# Altium schematic sheet Pg03_ AM335X Section 2 .SchDoc: PROCESSOR 2 OF 3
size A2; DrawnBy: RvS; DocumentNumber: 3; SheetNumber: 3; SheetTotal: 16; PageSetup: Record=PageOptions|CenterHorizontal=True|CenterVertical=True|PrintScale=0.51|XCorrection=1.00|YCorrection=1.00|PrintKind=1|BorderSize=5000000|LeftOffset=0|BottomOffset=0|Orientation=2|PaperLength=1000|PaperWidth=1000|Scale=100|PaperSource=15|PrintQuality=600|MediaType=1|DitherType=10|PaperKind=A4|PrintScaleMode=1
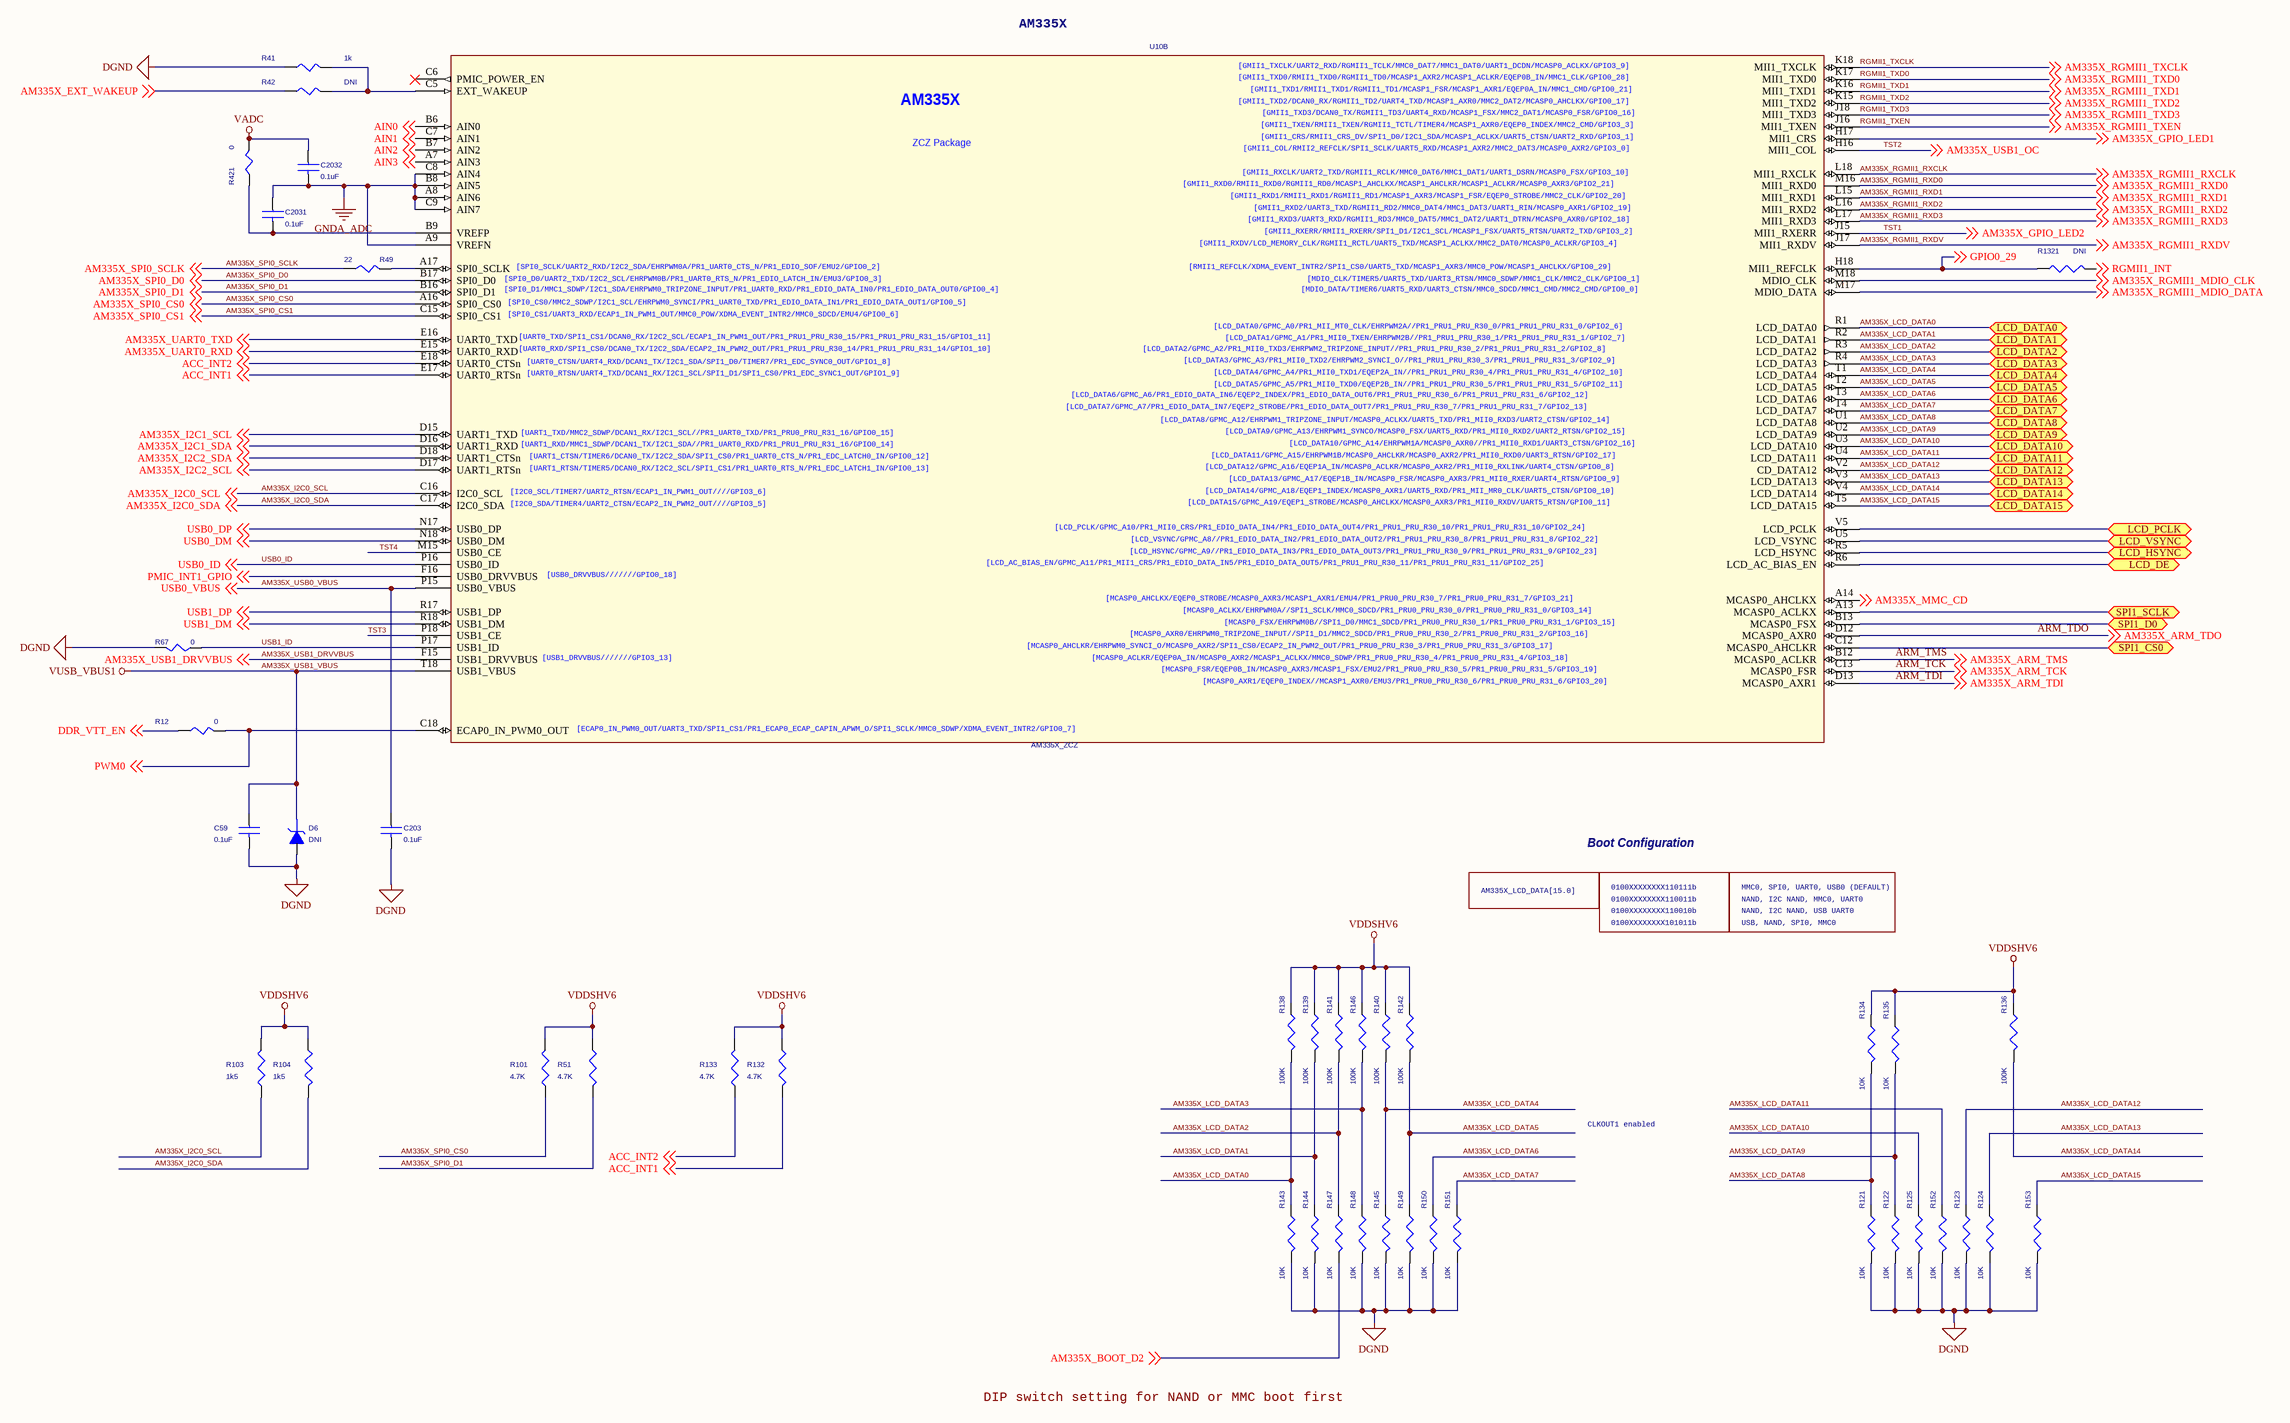
[diagram p0: Pg03_ AM335X Section 2 .SchDoc]

## Parts
?  (no value)  (graphical)
C59  0.1uF  [SM-7351-CAP-0402]
C203  0.1uF  [SM-7351-CAP-0402]
C2031  0.1uF  [SM-7351-CAP-0402]
C2032  0.1uF  [SM-7351-CAP-0402]
D6  DNI  [GMD2_2pin]
R12  0  [SM-7351-RES-0402]
R41  1k  [SM-7351-RES-0402]
R42  DNI  [SM-7351-RES-0402]
R49  22  [SM-7351-RES-0402]
R51  4.7K  [SM-7351-RES-0402]
R67  0  [SM-7351-RES-0402]
R101  4.7K  [SM-7351-RES-0402]
R103  1k5  [SM-7351-RES-0402]
R104  1k5  [SM-7351-RES-0402]
R121  10K  [SM-7351-RES-0402]
R122  10K  [SM-7351-RES-0402]
R123  10K  [SM-7351-RES-0402]
R124  10K  [SM-7351-RES-0402]
R125  10K  [SM-7351-RES-0402]
R132  4.7K  [SM-7351-RES-0402]
R133  4.7K  [SM-7351-RES-0402]
R134  10K  [SM-7351-RES-0402]
R135  10K  [SM-7351-RES-0402]
R136  100K  [SM-7351-RES-0402]
R138  100K  [SM-7351-RES-0402]
R139  100K  [SM-7351-RES-0402]
R140  100K  [SM-7351-RES-0402]
R141  100K  [SM-7351-RES-0402]
R142  100K  [SM-7351-RES-0402]
R143  10K  [SM-7351-RES-0402]
R144  10K  [SM-7351-RES-0402]
R145  10K  [SM-7351-RES-0402]
R146  100K  [SM-7351-RES-0402]
R147  10K  [SM-7351-RES-0402]
R148  10K  [SM-7351-RES-0402]
R149  10K  [SM-7351-RES-0402]
R150  10K  [SM-7351-RES-0402]
R151  10K  [SM-7351-RES-0402]
R152  10K  [SM-7351-RES-0402]
R153  10K  [SM-7351-RES-0402]
R421  0  [SM-7351-RES-0402]
R1321  DNI  [SM-7351-RES-0402]
U10  AM335X_ZCZ  [BGA15X15-324-55M]  (part B of 3)

## Ports
LCD_DATA0, LCD_DATA1, LCD_DATA2, LCD_DATA3, LCD_DATA4, LCD_DATA5, LCD_DATA6, LCD_DATA7, LCD_DATA8, LCD_DATA9, LCD_DATA10, LCD_DATA11, LCD_DATA12, LCD_DATA13, LCD_DATA14, LCD_DATA15, LCD_DE, LCD_HSYNC, LCD_PCLK, LCD_VSYNC, SPI1_CS0, SPI1_D0, SPI1_SCLK

## Nets
AM335X_USB1_VBUS: C59.1 D6.1(CATHODE) U10.T18(USB1_VBUS)  [also labelled VUSB_VBUS1]
DGND: C59.2 C203.2 D6.2(ANODE) R41.2(P2) R67.1(P1) R121.1(P1) R122.1(P1) R123.1(P1) R124.1(P1) R125.1(P1) R143.1(P1) R144.1(P1) R145.1(P1) R148.1(P1) R149.1(P1) R150.1(P1) R151.1(P1) R152.1(P1) R153.1(P1)
GNDA_ADC: C2031.1 C2032.2 U10.A8(AIN6) U10.A9(VREFN) U10.B8(AIN5) U10.C8(AIN4) U10.C9(AIN7)
VADC: C2032.1 R421.1(P1)
VDDSHV6: R51.2(P2) R101.2(P2) R103.2(P2) R104.2(P2) R132.2(P2) R133.2(P2) R134.2(P2) R135.2(P2) R136.2(P2) R138.2(P2) R139.2(P2) R140.2(P2) R141.2(P2) R142.2(P2) R146.2(P2)
ACC_INT1: R132.1(P1) U10.E17(UART0_RTSn) ; off-sheet ACC_INT1
ACC_INT2: R133.1(P1) U10.E18(UART0_CTSn) ; off-sheet ACC_INT2
AIN0: U10.B6(AIN0) ; off-sheet AIN0
AIN1: U10.C7(AIN1) ; off-sheet AIN1
AIN2: U10.B7(AIN2) ; off-sheet AIN2
AIN3: U10.A7(AIN3) ; off-sheet AIN3
AM335X_BOOT_D2: R147.1(P1) ; off-sheet AM335X_BOOT_D2
AM335X_EXT_WAKEUP: R42.2(P2) ; off-sheet AM335X_EXT_WAKEUP
AM335X_GPIO_LED1: U10.H17(MII1_CRS) ; off-sheet AM335X_GPIO_LED1
AM335X_I2C0_SCL: R103.1(P1) U10.C16(I2C0_SCL) ; off-sheet AM335X_I2C0_SCL
AM335X_I2C0_SDA: R104.1(P1) U10.C17(I2C0_SDA) ; off-sheet AM335X_I2C0_SDA
AM335X_I2C1_SCL: U10.D15(UART1_TXD) ; off-sheet AM335X_I2C1_SCL
AM335X_I2C1_SDA: U10.D16(UART1_RXD) ; off-sheet AM335X_I2C1_SDA
AM335X_I2C2_SCL: U10.D17(UART1_RTSn) ; off-sheet AM335X_I2C2_SCL
AM335X_I2C2_SDA: U10.D18(UART1_CTSn) ; off-sheet AM335X_I2C2_SDA
AM335X_LCD_DATA0: R138.1(P1) R143.2(P2) U10.R1(LCD_DATA0) ; port LCD_DATA0
AM335X_LCD_DATA1: R139.1(P1) R144.2(P2) U10.R2(LCD_DATA1) ; port LCD_DATA1
AM335X_LCD_DATA2: R141.1(P1) R147.2(P2) U10.R3(LCD_DATA2) ; port LCD_DATA2
AM335X_LCD_DATA3: R146.1(P1) R148.2(P2) U10.R4(LCD_DATA3) ; port LCD_DATA3
AM335X_LCD_DATA4: R140.1(P1) R145.2(P2) U10.T1(LCD_DATA4) ; port LCD_DATA4
AM335X_LCD_DATA5: R142.1(P1) R149.2(P2) U10.T2(LCD_DATA5) ; port LCD_DATA5
AM335X_LCD_DATA6: R150.2(P2) U10.T3(LCD_DATA6) ; port LCD_DATA6
AM335X_LCD_DATA7: R151.2(P2) U10.T4(LCD_DATA7) ; port LCD_DATA7
AM335X_LCD_DATA8: R121.2(P2) R134.1(P1) U10.U1(LCD_DATA8) ; port LCD_DATA8
AM335X_LCD_DATA9: R122.2(P2) R135.1(P1) U10.U2(LCD_DATA9) ; port LCD_DATA9
AM335X_LCD_DATA10: R125.2(P2) U10.U3(LCD_DATA10) ; port LCD_DATA10
AM335X_LCD_DATA11: R152.2(P2) U10.U4(LCD_DATA11) ; port LCD_DATA11
AM335X_LCD_DATA12: R123.2(P2) U10.V2(CD_DATA12) ; port LCD_DATA12
AM335X_LCD_DATA13: R124.2(P2) U10.V3(LCD_DATA13) ; port LCD_DATA13
AM335X_LCD_DATA14: R136.1(P1) U10.V4(LCD_DATA14) ; port LCD_DATA14
AM335X_LCD_DATA15: R153.2(P2) U10.T5(LCD_DATA15) ; port LCD_DATA15
AM335X_MMC_CD: U10.A14(MCASP0_AHCLKX) ; off-sheet AM335X_MMC_CD
AM335X_RGMII1_MDIO_CLK: U10.M18(MDIO_CLK) ; off-sheet AM335X_RGMII1_MDIO_CLK
AM335X_RGMII1_MDIO_DATA: U10.M17(MDIO_DATA) ; off-sheet AM335X_RGMII1_MDIO_DATA
AM335X_RGMII1_RXCLK: U10.L18(MII1_RXCLK) ; off-sheet AM335X_RGMII1_RXCLK
AM335X_RGMII1_RXD0: U10.M16(MII1_RXD0) ; off-sheet AM335X_RGMII1_RXD0
AM335X_RGMII1_RXD1: U10.L15(MII1_RXD1) ; off-sheet AM335X_RGMII1_RXD1
AM335X_RGMII1_RXD2: U10.L16(MII1_RXD2) ; off-sheet AM335X_RGMII1_RXD2
AM335X_RGMII1_RXD3: U10.L17(MII1_RXD3) ; off-sheet AM335X_RGMII1_RXD3
AM335X_RGMII1_RXDV: U10.J17(MII1_RXDV) ; off-sheet AM335X_RGMII1_RXDV
AM335X_SPI0_CS0: R101.1(P1) U10.A16(SPI0_CS0) ; off-sheet AM335X_SPI0_CS0
AM335X_SPI0_CS1: U10.C15(SPI0_CS1) ; off-sheet AM335X_SPI0_CS1
AM335X_SPI0_D0: U10.B17(SPI0_D0) ; off-sheet AM335X_SPI0_D0
AM335X_SPI0_D1: R51.1(P1) U10.B16(SPI0_D1) ; off-sheet AM335X_SPI0_D1
AM335X_SPI0_SCLK: R49.2(P2) ; off-sheet AM335X_SPI0_SCLK
AM335X_UART0_RXD: U10.E15(UART0_RXD) ; off-sheet AM335X_UART0_RXD
AM335X_UART0_TXD: U10.E16(UART0_TXD) ; off-sheet AM335X_UART0_TXD
AM335X_USB0_VBUS: C203.1 U10.P15(USB0_VBUS) ; off-sheet USB0_VBUS  [also labelled USB0_VBUS]
AM335X_USB1_DRVVBUS: U10.F15(USB1_DRVVBUS) ; off-sheet AM335X_USB1_DRVVBUS
ARM_TCK: U10.C13(MCASP0_FSR) ; off-sheet AM335X_ARM_TCK  [also labelled AM335X_ARM_TCK]
ARM_TDI: U10.D13(MCASP0_AXR1) ; off-sheet AM335X_ARM_TDI  [also labelled AM335X_ARM_TDI]
ARM_TDO: U10.D12(MCASP0_AXR0) ; off-sheet AM335X_ARM_TDO  [also labelled AM335X_ARM_TDO]
ARM_TMS: U10.B12(MCASP0_ACLKR) ; off-sheet AM335X_ARM_TMS  [also labelled AM335X_ARM_TMS]
DDR_VTT_EN: R12.2(P2) ; off-sheet DDR_VTT_EN
GPIO0_29: R1321.2(P2) U10.H18(MII1_REFCLK) ; off-sheet GPIO0_29
LCD_DE: U10.R6(LCD_AC_BIAS_EN) ; port LCD_DE
LCD_HSYNC: U10.R5(LCD_HSYNC) ; port LCD_HSYNC
LCD_PCLK: U10.V5(LCD_PCLK) ; port LCD_PCLK
LCD_VSYNC: U10.U5(LCD_VSYNC) ; port LCD_VSYNC
PMIC_INT1_GPIO: U10.F16(USB0_DRVVBUS) ; off-sheet PMIC_INT1_GPIO
PWM0: R12.1(P1) U10.C18(ECAP0_IN_PWM0_OUT) ; off-sheet PWM0
RGMII1_INT: R1321.1(P1) ; off-sheet RGMII1_INT
RGMII1_TXCLK: U10.K18(MII1_TXCLK) ; off-sheet AM335X_RGMII1_TXCLK  [also labelled AM335X_RGMII1_TXCLK]
RGMII1_TXD0: U10.K17(MII1_TXD0) ; off-sheet AM335X_RGMII1_TXD0  [also labelled AM335X_RGMII1_TXD0]
RGMII1_TXD1: U10.K16(MII1_TXD1) ; off-sheet AM335X_RGMII1_TXD1  [also labelled AM335X_RGMII1_TXD1]
RGMII1_TXD2: U10.K15(MII1_TXD2) ; off-sheet AM335X_RGMII1_TXD2  [also labelled AM335X_RGMII1_TXD2]
RGMII1_TXD3: U10.J18(MII1_TXD3) ; off-sheet AM335X_RGMII1_TXD3  [also labelled AM335X_RGMII1_TXD3]
RGMII1_TXEN: U10.J16(MII1_TXEN) ; off-sheet AM335X_RGMII1_TXEN  [also labelled AM335X_RGMII1_TXEN]
SPI1_CS0: U10.C12(MCASP0_AHCLKR) ; port SPI1_CS0
SPI1_D0: U10.B13(MCASP0_FSX) ; port SPI1_D0
SPI1_SCLK: U10.A13(MCASP0_ACLKX) ; port SPI1_SCLK
TST1: U10.J15(MII1_RXERR) ; off-sheet AM335X_GPIO_LED2  [also labelled AM335X_GPIO_LED2]
TST2: U10.H16(MII1_COL) ; off-sheet AM335X_USB1_OC  [also labelled AM335X_USB1_OC]
TST3: U10.P18(USB1_CE)
TST4: U10.M15(USB0_CE)
USB0_DM: U10.N18(USB0_DM) ; off-sheet USB0_DM
USB0_DP: U10.N17(USB0_DP) ; off-sheet USB0_DP
USB0_ID: U10.P16(USB0_ID) ; off-sheet USB0_ID
USB1_DM: U10.R18(USB1_DM) ; off-sheet USB1_DM
USB1_DP: U10.R17(USB1_DP) ; off-sheet USB1_DP
USB1_ID: R67.2(P2) U10.P17(USB1_ID)
NetC2031_2: C2031.2 R421.2(P2) U10.B9(VREFP)
NetR41_1: R41.1(P1) R42.1(P1) U10.C5(EXT_WAKEUP)
NetR49_1: R49.1(P1) U10.A17(SPI0_SCLK)

Not connected (* = marked no-connect by the designer): U10 C6(PMIC_POWER_EN)*

## Notes on the sheet
- (near U10) AM335X
- Boot Configuration
- AM335X_LCD_DATA[15.0]
- 0100XXXXXXXX110111b
- 0100XXXXXXXX110011b
- 0100XXXXXXXX110010b
- 0100XXXXXXXX101011b
- MMC0, SPI0, UART0, USB0 (DEFAULT)
- NAND, I2C NAND, MMC0, UART0
- NAND, I2C NAND, USB UART0
- USB, NAND, SPI0, MMC0
- CLKOUT1 enabled
- DIP switch setting for NAND or MMC boot first
- Embedded Vision Systems Group
- Title
- School of Electrical and Electronic Engineering
- Date:
- Size
- Document Number
- Sheet
- of
- Rev
- (in symbol AM335X_15mmx15mm, part B) [GMII1_TXCLK/UART2_RXD/RGMII1_TCLK/MMC0_DAT7/MMC1_DAT0/UART1_DCDN/MCASP0_ACLKX/GPIO3_9]; [GMII1_TXD0/RMII1_TXD0/RGMII1_TD0/MCASP1_AXR2/MCASP1_ACLKR/EQEP0B_IN/MMC1_CLK/GPIO0_28]; [GMII1_TXD1/RMII1_TXD1/RGMII1_TD1/MCASP1_FSR/MCASP1_AXR1/EQEP0A_IN/MMC1_CMD/GPIO0_21]; AM335X; [GMII1_TXD2/DCAN0_RX/RGMII1_TD2/UART4_TXD/MCASP1_AXR0/MMC2_DAT2/MCASP0_AHCLKX/GPIO0_17]; [GMII1_TXD3/DCAN0_TX/RGMII1_TD3/UART4_RXD/MCASP1_FSX/MMC2_DAT1/MCASP0_FSR/GPIO0_16]; [GMII1_TXEN/RMII1_TXEN/RGMII1_TCTL/TIMER4/MCASP1_AXR0/EQEP0_INDEX/MMC2_CMD/GPIO3_3]; [GMII1_CRS/RMII1_CRS_DV/SPI1_D0/I2C1_SDA/MCASP1_ACLKX/UART5_CTSN/UART2_RXD/GPIO3_1]; ZCZ Package; [GMII1_COL/RMII2_REFCLK/SPI1_SCLK/UART5_RXD/MCASP1_AXR2/MMC2_DAT3/MCASP0_AXR2/GPIO3_0]; [GMII1_RXCLK/UART2_TXD/RGMII1_RCLK/MMC0_DAT6/MMC1_DAT1/UART1_DSRN/MCASP0_FSX/GPIO3_10]; [GMII1_RXD0/RMII1_RXD0/RGMII1_RD0/MCASP1_AHCLKX/MCASP1_AHCLKR/MCASP1_ACLKR/MCASP0_AXR3/GPIO2_21]; [GMII1_RXD1/RMII1_RXD1/RGMII1_RD1/MCASP1_AXR3/MCASP1_FSR/EQEP0_STROBE/MMC2_CLK/GPIO2_20]; [GMII1_RXD2/UART3_TXD/RGMII1_RD2/MMC0_DAT4/MMC1_DAT3/UART1_RIN/MCASP0_AXR1/GPIO2_19]; [GMII1_RXD3/UART3_RXD/RGMII1_RD3/MMC0_DAT5/MMC1_DAT2/UART1_DTRN/MCASP0_AXR0/GPIO2_18]; [GMII1_RXERR/RMII1_RXERR/SPI1_D1/I2C1_SCL/MCASP1_FSX/UART5_RTSN/UART2_TXD/GPIO3_2]; [GMII1_RXDV/LCD_MEMORY_CLK/RGMII1_RCTL/UART5_TXD/MCASP1_ACLKX/MMC2_DAT0/MCASP0_ACLKR/GPIO3_4]; [SPI0_SCLK/UART2_RXD/I2C2_SDA/EHRPWM0A/PR1_UART0_CTS_N/PR1_EDIO_SOF/EMU2/GPIO0_2]; [RMII1_REFCLK/XDMA_EVENT_INTR2/SPI1_CS0/UART5_TXD/MCASP1_AXR3/MMC0_POW/MCASP1_AHCLKX/GPIO0_29]; [SPI0_D0/UART2_TXD/I2C2_SCL/EHRPWM0B/PR1_UART0_RTS_N/PR1_EDIO_LATCH_IN/EMU3/GPIO0_3]; [MDIO_CLK/TIMER5/UART5_TXD/UART3_RTSN/MMC0_SDWP/MMC1_CLK/MMC2_CLK/GPIO0_1]; [SPI0_D1/MMC1_SDWP/I2C1_SDA/EHRPWM0_TRIPZONE_INPUT/PR1_UART0_RXD/PR1_EDIO_DATA_IN0/PR1_EDIO_DATA_OUT0/GPIO0_4]; [MDIO_DATA/TIMER6/UART5_RXD/UART3_CTSN/MMC0_SDCD/MMC1_CMD/MMC2_CMD/GPIO0_0]; [SPI0_CS0/MMC2_SDWP/I2C1_SCL/EHRPWM0_SYNCI/PR1_UART0_TXD/PR1_EDIO_DATA_IN1/PR1_EDIO_DATA_OUT1/GPIO0_5]; [SPI0_CS1/UART3_RXD/ECAP1_IN_PWM1_OUT/MMC0_POW/XDMA_EVENT_INTR2/MMC0_SDCD/EMU4/GPIO0_6]; [LCD_DATA0/GPMC_A0/PR1_MII_MT0_CLK/EHRPWM2A//PR1_PRU1_PRU_R30_0/PR1_PRU1_PRU_R31_0/GPIO2_6]; [UART0_TXD/SPI1_CS1/DCAN0_RX/I2C2_SCL/ECAP1_IN_PWM1_OUT/PR1_PRU1_PRU_R30_15/PR1_PRU1_PRU_R31_15/GPIO1_11]; [LCD_DATA1/GPMC_A1/PR1_MII0_TXEN/EHRPWM2B//PR1_PRU1_PRU_R30_1/PR1_PRU1_PRU_R31_1/GPIO2_7]; [UART0_RXD/SPI1_CS0/DCAN0_TX/I2C2_SDA/ECAP2_IN_PWM2_OUT/PR1_PRU1_PRU_R30_14/PR1_PRU1_PRU_R31_14/GPIO1_10]; [LCD_DATA2/GPMC_A2/PR1_MII0_TXD3/EHRPWM2_TRIPZONE_INPUT//PR1_PRU1_PRU_R30_2/PR1_PRU1_PRU_R31_2/GPIO2_8]; [LCD_DATA3/GPMC_A3/PR1_MII0_TXD2/EHRPWM2_SYNCI_O//PR1_PRU1_PRU_R30_3/PR1_PRU1_PRU_R31_3/GPIO2_9]; [UART0_CTSN/UART4_RXD/DCAN1_TX/I2C1_SDA/SPI1_D0/TIMER7/PR1_EDC_SYNC0_OUT/GPIO1_8]; [LCD_DATA4/GPMC_A4/PR1_MII0_TXD1/EQEP2A_IN//PR1_PRU1_PRU_R30_4/PR1_PRU1_PRU_R31_4/GPIO2_10]; [UART0_RTSN/UART4_TXD/DCAN1_RX/I2C1_SCL/SPI1_D1/SPI1_CS0/PR1_EDC_SYNC1_OUT/GPIO1_9]; [LCD_DATA5/GPMC_A5/PR1_MII0_TXD0/EQEP2B_IN//PR1_PRU1_PRU_R30_5/PR1_PRU1_PRU_R31_5/GPIO2_11]; [LCD_DATA6/GPMC_A6/PR1_EDIO_DATA_IN6/EQEP2_INDEX/PR1_EDIO_DATA_OUT6/PR1_PRU1_PRU_R30_6/PR1_PRU1_PRU_R31_6/GPIO2_12]; [LCD_DATA7/GPMC_A7/PR1_EDIO_DATA_IN7/EQEP2_STROBE/PR1_EDIO_DATA_OUT7/PR1_PRU1_PRU_R30_7/PR1_PRU1_PRU_R31_7/GPIO2_13]; [LCD_DATA8/GPMC_A12/EHRPWM1_TRIPZONE_INPUT/MCASP0_ACLKX/UART5_TXD/PR1_MII0_RXD3/UART2_CTSN/GPIO2_14]; [LCD_DATA9/GPMC_A13/EHRPWM1_SYNCO/MCASP0_FSX/UART5_RXD/PR1_MII0_RXD2/UART2_RTSN/GPIO2_15]; [UART1_TXD/MMC2_SDWP/DCAN1_RX/I2C1_SCL//PR1_UART0_TXD/PR1_PRU0_PRU_R31_16/GPIO0_15]; [LCD_DATA10/GPMC_A14/EHRPWM1A/MCASP0_AXR0//PR1_MII0_RXD1/UART3_CTSN/GPIO2_16]; [UART1_RXD/MMC1_SDWP/DCAN1_TX/I2C1_SDA//PR1_UART0_RXD/PR1_PRU1_PRU_R31_16/GPIO0_14]; [LCD_DATA11/GPMC_A15/EHRPWM1B/MCASP0_AHCLKR/MCASP0_AXR2/PR1_MII0_RXD0/UART3_RTSN/GPIO2_17]; [UART1_CTSN/TIMER6/DCAN0_TX/I2C2_SDA/SPI1_CS0/PR1_UART0_CTS_N/PR1_EDC_LATCH0_IN/GPIO0_12]; [LCD_DATA12/GPMC_A16/EQEP1A_IN/MCASP0_ACLKR/MCASP0_AXR2/PR1_MII0_RXLINK/UART4_CTSN/GPIO0_8]; [UART1_RTSN/TIMER5/DCAN0_RX/I2C2_SCL/SPI1_CS1/PR1_UART0_RTS_N/PR1_EDC_LATCH1_IN/GPIO0_13]; [LCD_DATA13/GPMC_A17/EQEP1B_IN/MCASP0_FSR/MCASP0_AXR3/PR1_MII0_RXER/UART4_RTSN/GPIO0_9]; [LCD_DATA14/GPMC_A18/EQEP1_INDEX/MCASP0_AXR1/UART5_RXD/PR1_MII_MR0_CLK/UART5_CTSN/GPIO0_10]; [I2C0_SCL/TIMER7/UART2_RTSN/ECAP1_IN_PWM1_OUT////GPIO3_6]; [LCD_DATA15/GPMC_A19/EQEP1_STROBE/MCASP0_AHCLKX/MCASP0_AXR3/PR1_MII0_RXDV/UART5_RTSN/GPIO0_11]; [I2C0_SDA/TIMER4/UART2_CTSN/ECAP2_IN_PWM2_OUT////GPIO3_5]; [LCD_PCLK/GPMC_A10/PR1_MII0_CRS/PR1_EDIO_DATA_IN4/PR1_EDIO_DATA_OUT4/PR1_PRU1_PRU_R30_10/PR1_PRU1_PRU_R31_10/GPIO2_24]; [LCD_VSYNC/GPMC_A8//PR1_EDIO_DATA_IN2/PR1_EDIO_DATA_OUT2/PR1_PRU1_PRU_R30_8/PR1_PRU1_PRU_R31_8/GPIO2_22]; [LCD_HSYNC/GPMC_A9//PR1_EDIO_DATA_IN3/PR1_EDIO_DATA_OUT3/PR1_PRU1_PRU_R30_9/PR1_PRU1_PRU_R31_9/GPIO2_23]; [LCD_AC_BIAS_EN/GPMC_A11/PR1_MII1_CRS/PR1_EDIO_DATA_IN5/PR1_EDIO_DATA_OUT5/PR1_PRU1_PRU_R30_11/PR1_PRU1_PRU_R31_11/GPIO2_25]; [USB0_DRVVBUS///////GPIO0_18]; [MCASP0_AHCLKX/EQEP0_STROBE/MCASP0_AXR3/MCASP1_AXR1/EMU4/PR1_PRU0_PRU_R30_7/PR1_PRU0_PRU_R31_7/GPIO3_21]; [MCASP0_ACLKX/EHRPWM0A//SPI1_SCLK/MMC0_SDCD/PR1_PRU0_PRU_R30_0/PR1_PRU0_PRU_R31_0/GPIO3_14]; [MCASP0_FSX/EHRPWM0B//SPI1_D0/MMC1_SDCD/PR1_PRU0_PRU_R30_1/PR1_PRU0_PRU_R31_1/GPIO3_15]; [MCASP0_AXR0/EHRPWM0_TRIPZONE_INPUT//SPI1_D1/MMC2_SDCD/PR1_PRU0_PRU_R30_2/PR1_PRU0_PRU_R31_2/GPIO3_16]; [MCASP0_AHCLKR/EHRPWM0_SYNCI_O/MCASP0_AXR2/SPI1_CS0/ECAP2_IN_PWM2_OUT/PR1_PRU0_PRU_R30_3/PR1_PRU0_PRU_R31_3/GPIO3_17]; [USB1_DRVVBUS///////GPIO3_13]; [MCASP0_ACLKR/EQEP0A_IN/MCASP0_AXR2/MCASP1_ACLKX/MMC0_SDWP/PR1_PRU0_PRU_R30_4/PR1_PRU0_PRU_R31_4/GPIO3_18]; [MCASP0_FSR/EQEP0B_IN/MCASP0_AXR3/MCASP1_FSX/EMU2/PR1_PRU0_PRU_R30_5/PR1_PRU0_PRU_R31_5/GPIO3_19]; [MCASP0_AXR1/EQEP0_INDEX//MCASP1_AXR0/EMU3/PR1_PRU0_PRU_R30_6/PR1_PRU0_PRU_R31_6/GPIO3_20]; [ECAP0_IN_PWM0_OUT/UART3_TXD/SPI1_CS1/PR1_ECAP0_ECAP_CAPIN_APWM_O/SPI1_SCLK/MMC0_SDWP/XDMA_EVENT_INTR2/GPIO0_7]

## Library data of the parts
? = Title Block Address(1): UoM title block
C59 C203 C2031 C2032 = 0.1uFCapacitor16V10%0402_Dup1: TIIntPartnumber: 1C0089; MfrNum: C0402C104K4RACT; Mfr: Kemet; PartName: 0.1uF16V10%SMD0402; DescriptiveText: Capacitor 0.1uF 16V 10% 0402 X7R; Cost10K: 0.015; Cost100: 0.11; Vendor: Digikey
D6 = Diode_Zener_5.1V_100mW: Voltage Surpressor 15.0V; PartName: DiodeZener5.1V_100mW; Mfr: Rohm; MfrNum: GDZT2R5.1; TIIntPartnumber: 1E0020; DescriptiveText: Diode Zener 5.1V 100mW; Vendor: Digikey; Cost100: 0.149; Cost10K: 0.068; Descriptive_Text: Voltage Surpressor 15.0V
R12 = ZeroOhmResistor1/16W0402: PartName: ZeroohmSMD0402; Mfr: Panasonic; MfrNum: ERJ-2GE0R00X; TIIntPartnumber: 1R0098; DescriptiveText: Resistor Zero ohm Jumper 0402; Vendor: Digikey; Cost100: 0.08; Cost10K: 0.0020
R41 R42 R421 = ZeroOhmResistor1/16W0402_Dup2: Resistor Zero ohm Jumper 0402; PartName: ZeroohmSMD0402; Mfr: Panasonic; MfrNum: ERJ-2GE0R00X; TIIntPartnumber: 1R0098; Vendor: DIGIKEY; Cost100: 0.08; Cost10K: 0.0020; DescriptiveText: Resistor Zero ohm Jumper 0402; Descriptive_Text: Resistor Zero ohm Jumper 0402
R49 = 22OhmResistor1/16W1%0402: Resistor 22 ohm 1/16W 1% 0402; PartName: 22ohm1/161%smd0402; Mfr: ROHM; MfrNum: MCR01MZPF22R0; TIIntPartnumber: 1R0175; Vendor: Digikey; Cost100: 0.069; Cost10K: 0.00529; DescriptiveText: Resistor 22 ohm 1/16W 1% 0402; Descriptive_Text: Resistor 22 ohm 1/16W 1% 0402
R51 R101 R103 R104 R132 R133 R1321 = 4.7KOhmResistor1/16W0402_Dup1: Resistor 4.7Kohm 1/16W 5% 0402; TIIntPartnumber: 1R0183; MfrNum: RMCF0402JT4K70; Mfr: Stackpole Electronics; PartName: 4.7Kohm1/16W5%smd0402; Cost10K: 0.02465; Cost100: 0.007; Vendor: Digikey; DescriptiveText: Resistor 4.7Kohm 1/16W 5% 0402; Descriptive_Text: Resistor 4.7Kohm 1/16W 5% 0402
R67 = ZeroOhmResistor1/16W0402_Dup4: Resistor Zero ohm Jumper 0402; TIIntPartnumber: 1R0098; MfrNum: ERJ-2GE0R00X; Mfr: Panasonic; PartName: ZeroohmSMD0402; Cost10K: 0.0020; Cost100: 0.08; Vendor: Digikey; Descriptive_Text: Resistor Zero ohm Jumper 0402; DescriptiveText: Resistor Zero ohm Jumper 0402
R121-R125 R134 R135 R143-R145 R147-R153 = 10KOhmResistor1/16W0402_Dup1: Resistor 10Kohm 1/16W 5% 0402; TIIntPartnumber: 1R0168; MfrNum: MCR01MZPJ103; Mfr: Rohm; PartName: 10Kohm1/16W5%SMD0402; Cost10K: 0.0017; Cost100: 0.03; Vendor: Digikey; Descriptive_Text: Resistor 10Kohm 1/16W 5% 0402; DescriptiveText: Resistor 10Kohm 1/16W 5% 0402
R136 R138-R142 R146 = 100KOhmResistor1/16W0402_Dup1: TIIntPartnumber: 1R0181; MfrNum: RMCF0402FT100K; Mfr: Stackpole Electronics; PartName: 100Kohm1/16W1%SMD0402; DescriptiveText: Resistor 100Kohm 1/16W 1% 0402; Cost10K: 0.0020; Cost100: 0.0105; Vendor: Digikey
U10 = AM335X_15mmx15mm: TIIntPartnumber: 1A0242; MfrNum: XAM3359ZCZ; Mfr: TI; PartName: AM335X_15x15; Cost10K: 4.1; Cost100: 10.00; Vendor: Arrow; DescriptiveText: ARM MPU Cortex A8 Processor ZCZ Package